# Altium schematic sheet main.SchDoc
size A3; Author: Roniere Rezende; SheetNumber: 1; SheetTotal: 1; SPICEModelCacheXJWXHROJ: <root> / <DocumentId>XJWXHROJ</DocumentId> / <CacheFrame Number="0"> / <Model Name="cap" Kind="MDL"> / <Text>*Default semiconductor capacitor / .MODEL CAP C()</Text> / </Model> / </CacheFrame> / </root>
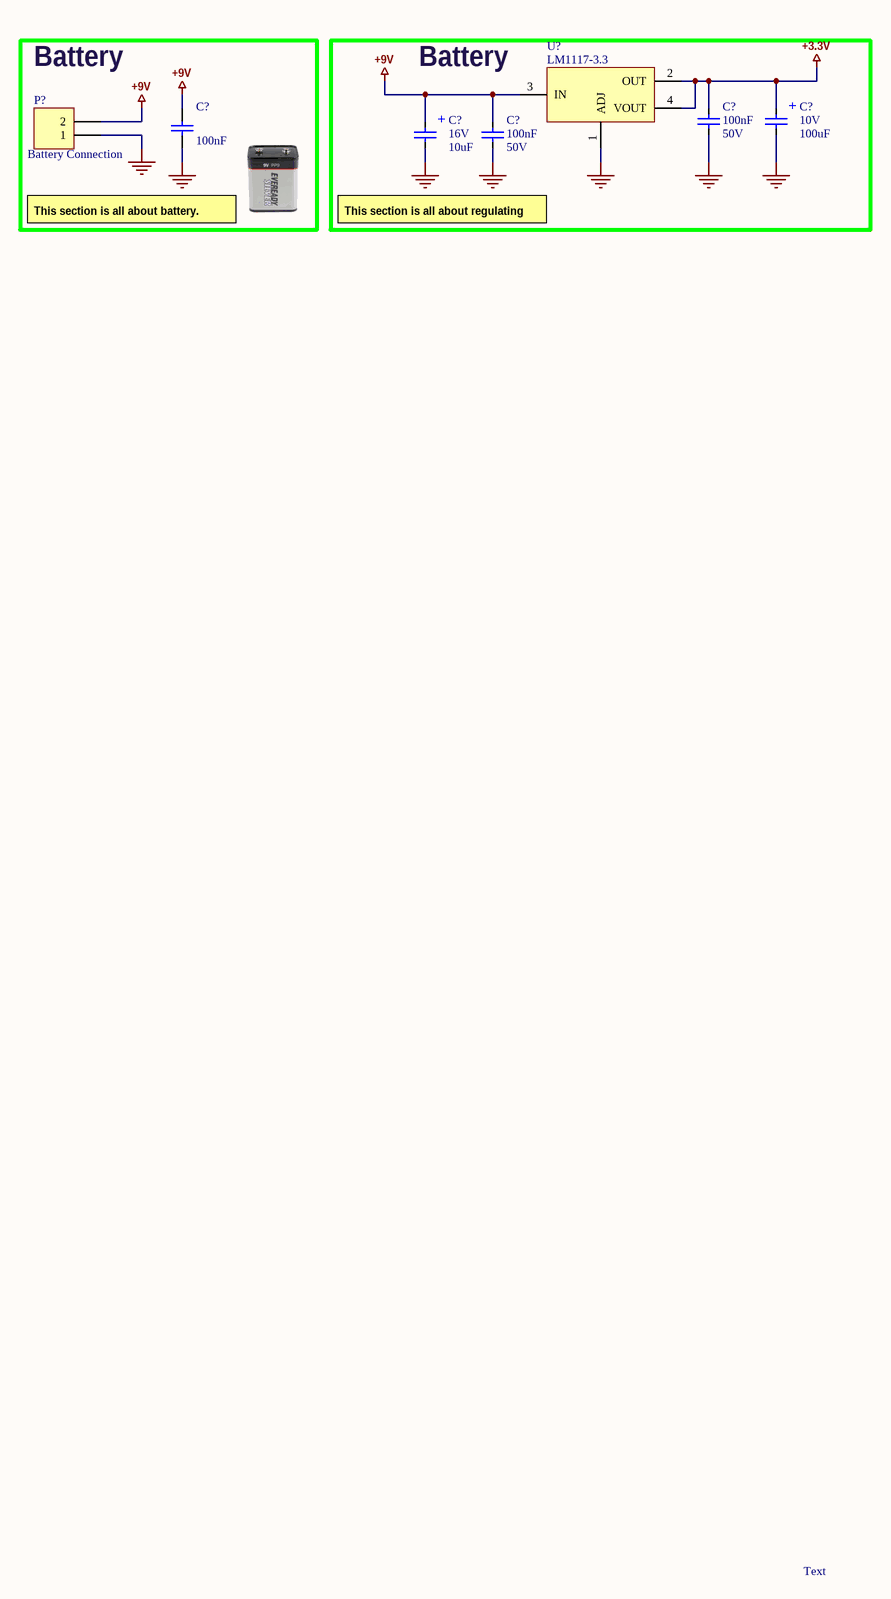
[diagram p0: main.SchDoc]

## Parts
(Parts that share a designator on the sheet are numbered #1, #2 ... from top to bottom, then left to right.)
C?#1  value 100nF  [C1206]  (hidden comment: Cap Semi)
C?#2  Voltage Rating: 50V  Capacitance: 100nF  (hidden comment: CAP CER 0.1UF 50V X7R 0805)
C?#3  Voltage Rating: 10V  Capacitance: 100uF  [CAPACITOR_TAN_1206_H]  (hidden comment: CAP TANT 100UF 20% 10V 1206)
C?#4  Voltage Rating: 16V  Capacitance: 10uF  [CAPACITOR_TAN_1206_H]  (hidden comment: CAP TANT 10UF 10% 16V 1206)
C?#5  Voltage Rating: 50V  Capacitance: 100nF  (hidden comment: CAP CER 0.1UF 50V X7R 0805)
P?  Battery Connection  [HDR1X2H]
U?  Series: LM1117-3.3  [SOT-223-4]  (hidden comment: IC REG LIN 3.3V 800MA SOT223-4)

## Blocks framed on the sheet
Battery: C?#1 P?
Battery: C?#2-C?#5 U?

## Nets
+3.3V: C?#2.2 C?#3.1 U?.2(OUT) U?.4(VOUT)
+9V: C?#1.1 C?#4.1 C?#5.2 P?.2 U?.3(IN)
GND: C?#1.2 C?#2.1 C?#3.2 C?#4.2 C?#5.1 P?.1 U?.1(ADJ)

## Notes on the sheet
- This section is all about battery.
- This section is all about regulating voltage from 9V to 3.3V.
- Text
- (in symbol TAJA106K016RNJ) +
- (in symbol TLJA107M010R1400) +

## Library data of the parts
C?#1 = Cap Semi: Capacitor (Semiconductor SIM Model); Published: 8-Jun-2000; LatestRevisionDate: 29-May-2009; LatestRevisionNote: IPC-7351 Footprint Added.; PackageReference: C1206; Publisher: Altium Limited; PackageDescription: Chip Capacitor
C?#2 C?#5 = CC0805KRX7R9BB104: 0.1 µF ±10% 50V Ceramic Capacitor X7R 0805 (2012 Metric); Manufacturer: Yageo; Insulation Resistance: 100GR; Supplier 1: Future Electronics; Supplier Part Number 1: 2986263; Manufacturer Part Number: CC0805KRX7R9BB104; RoHS: Yes; Category: Ceramic Capacitors; Stock 1: 13596000; Pricing 1: 4000=0.0097, 16000=0.0092, 40000=0.0089, 100000=0.0086, 160000=0.0082 (USD); Mount: Surface Mount; Case/Package: 0805; Number of Pins: 2; Case Code (Metric): 2012; Case Code (Imperial): 0805; Material: Ceramic; Min Operating Temperature: -55°C; Max Operating Temperature: 125°C; Packaging: Tape and Reel; Tolerance: 10%; Package Quantity: 4000; Dielectric: X7R; Termination: SMD/SMT; Voltage: 50V; Series: CC; Length: 2mm; Height: 0.85mm; Depth: 1.25mm; Radiation Hardening: No; Reach SVHC Compliant: No; Lead Free: Lead Free; Halogen Free: Halogen Free; RoHS Compliant: Yes; ComponentLink1URL: https://datasheet.ciiva.com/11786/0900766b80d84f1d-11786009.pdf?src-supplier=Rs; ComponentLink1Description: https://datasheet.ciiva.com/11786/0900766b80d84f1d-11786009.pdf?src-supplier=Rs; ComponentLink2URL: https://datasheet.ciiva.com/155/mlccorderingcode-155929.pdf?src-supplier=Digikey; ComponentLink2Description: https://datasheet.ciiva.com/155/mlccorderingcode-155929.pdf?src-supplier=Digikey; ComponentLink3URL: https://datasheet.ciiva.com/155/mlccorderingcode-155930.pdf?src-supplier=Digikey; ComponentLink3Description: https://datasheet.ciiva.com/155/mlccorderingcode-155930.pdf?src-supplier=Digikey; ComponentLink4URL: https://datasheet.ciiva.com/155/mlccorderingcode-155931.pdf?src-supplier=Digikey; ComponentLink4Description: https://datasheet.ciiva.com/155/mlccorderingcode-155931.pdf?src-supplier=Digikey; ComponentLink5URL: https://datasheet.ciiva.com/11464/upy-gphc-x7r-6-3v-to-50v-8-11464757.pdf?src-supplier=Avnet; ComponentLink5Description: https://datasheet.ciiva.com/11464/upy-gphc-x7r-6-3v-to-50v-8-11464757.pdf?src-supplier=Avnet; ComponentLink6URL: https://datasheet.ciiva.com/46393/1734573-46393307.pdf?src-supplier=Element14; ComponentLink6Description: https://datasheet.ciiva.com/46393/1734573-46393307.pdf?src-supplier=Element14; ComponentLink7URL: https://datasheet.ciiva.com/28450/1489800-28450805.pdf?src-supplier=Element14; ComponentLink7Description: https://datasheet.ciiva.com/28450/1489800-28450805.pdf?src-supplier=Element14; ComponentLink8URL: https://datasheet.ciiva.com/29242/445210-da-01-en-kerko-chip-0805-x7r-0-1uf-10proz-50vg-29242074.pdf?src-supplier=Conrad; ComponentLink8Description: https://datasheet.ciiva.com/29242/445210-da-01-en-kerko-chip-0805-x7r-0-1uf-10proz-50vg-29242074.pdf?src-supplier=Conrad
C?#3 = TLJA107M010R1400: 100 µF Molded Tantalum Capacitors 10 V 1206 (3216 Metric) 1.4Ohm; Manufacturer: Kyocera AVX; ESR (Equivalent Series Resistance): 1.4R; Ripple Current: 231mA; Leakage Current: 10uA; Life (Hours): 2000Hour; Supplier 1: Avnet; Supplier Part Number 1: 11R8390; Manufacturer Part Number: TLJA107M010R1400; RoHS: Yes; Category: Tantalum Capacitors; Stock 1: 2050; Pricing 1: 1=0.863, 10=0.514, 25=0.483, 50=0.45, 100=0.419 (USD); Mount: Surface Mount; Case/Package: 1206; Number of Pins: 2; Case Code (Metric): 3216; Case Code (Imperial): 1206; Dielectric Material: Tantalum; Min Operating Temperature: -55°C; Max Operating Temperature: 125°C; Tolerance: 20%; Packaging: Tape and Reel; Package Quantity: 2000; Resistance: 1.4R; Termination: SMD/SMT; Voltage: 10V; Voltage Rating (DC): 10V; Features: General Purpose; Series: TLJ; Construction: Flat; Length: 3.2mm; Width: 1.6mm; Height: 1.6mm; Depth: 1.6mm; Lead Pitch: 1.1mm; Radiation Hardening: No; Lead Free: Lead Free; RoHS Compliant: Yes; ComponentLink1URL: https://datasheet.ciiva.com/264/tlj-264792.pdf?src-supplier=Digikey; ComponentLink1Description: https://datasheet.ciiva.com/264/tlj-264792.pdf?src-supplier=Digikey; ComponentLink2URL: https://datasheet.ciiva.com/264/tlj-264793.pdf?src-supplier=Digikey; ComponentLink2Description: https://datasheet.ciiva.com/264/tlj-264793.pdf?src-supplier=Digikey; ComponentLink3URL: https://datasheet.ciiva.com/264/tlj-264794.pdf?src-supplier=Digikey; ComponentLink3Description: https://datasheet.ciiva.com/264/tlj-264794.pdf?src-supplier=Digikey; ComponentLink4URL: https://datasheet.ciiva.com/11226/tlj-11226140.pdf?src-supplier=Avnet; ComponentLink4Description: https://datasheet.ciiva.com/11226/tlj-11226140.pdf?src-supplier=Avnet; ComponentLink5URL: https://datasheet.ciiva.com/16501/tlj-16501342.pdf?src-supplier=Future+Electronics; ComponentLink5Description: https://datasheet.ciiva.com/16501/tlj-16501342.pdf?src-supplier=Future+Electronics
C?#4 = TAJA106K016RNJ: 10 µF Molded Tantalum Capacitors 16 V 1206 (3216 Metric) 3Ohm; Manufacturer: Kyocera AVX; ESR (Equivalent Series Resistance): 3R; Leakage Current: 1.6uA; Dissipation Factor: 8%; Polarity: Polar; Frequency: 300MHz; Life (Hours): 2000Hour; Ripple Current: 158mA; Supplier 1: Avnet; Supplier Part Number 1: TAJA106K016RNJ; Manufacturer Part Number: TAJA106K016RNJ; RoHS: Yes; Category: Tantalum Capacitors; Stock 1: 284000; Pricing 1: 2000=0.08497, 4000=0.08299, 8000=0.08102, 12000=0.07904, 16000=0.07805 (USD); Mount: Surface Mount,PCB; Case/Package: 1206; Number of Pins: 2; Case Code (Metric): 3216; Case Code (Imperial): 1206; Dielectric Material: Tantalum; Min Operating Temperature: -55°C; Max Operating Temperature: 125°C; Tolerance: 10%; Packaging: Tape and Reel; Voltage Rating (DC): 16V; Features: General Purpose; Series: TAJ; Construction: Flat; Package Quantity: 1; Termination: SMD/SMT; Voltage: 16V; Voltage Rating (AC): 16V; Length: 3.2mm; Width: 1.6mm; Height: 1.6mm; Depth: 1.6mm; Size: 1.6mm; Height - Seated (Max): 0.071inch; Lead Pitch: 1.1mm; Radiation Hardening: No; Lead Free: Lead Free; RoHS Compliant: Yes; Reach SVHC Compliant: No; ComponentLink1URL: https://datasheet.ciiva.com/27051/1234933-27051768.pdf?src-supplier=Jameco; ComponentLink1Description: https://datasheet.ciiva.com/27051/1234933-27051768.pdf?src-supplier=Jameco; ComponentLink2URL: https://datasheet.ciiva.com/26341/559411-da-01-en-tacc-a-3-2-mm-x-1-6-mm-x-1-6-mm-10-uf-26341755.pdf?src-supplier=Conrad; ComponentLink2Description: https://datasheet.ciiva.com/26341/559411-da-01-en-tacc-a-3-2-mm-x-1-6-mm-x-1-6-mm-10-uf-26341755.pdf?src-supplier=Conrad; ComponentLink3URL: https://datasheet.ciiva.com/263/taj-263391.pdf?src-supplier=Digikey; ComponentLink3Description: https://datasheet.ciiva.com/263/taj-263391.pdf?src-supplier=Digikey; ComponentLink4URL: https://datasheet.ciiva.com/263/taj-263392.pdf?src-supplier=Digikey; ComponentLink4Description: https://datasheet.ciiva.com/263/taj-263392.pdf?src-supplier=Digikey; ComponentLink5URL: https://datasheet.ciiva.com/263/taj-263393.pdf?src-supplier=Digikey; ComponentLink5Description: https://datasheet.ciiva.com/263/taj-263393.pdf?src-supplier=Digikey; ComponentLink6URL: https://datasheet.ciiva.com/3004/taj-3004387.pdf?src-supplier=Avnet; ComponentLink6Description: https://datasheet.ciiva.com/3004/taj-3004387.pdf?src-supplier=Avnet; ComponentLink7URL: https://datasheet.ciiva.com/3004/taj-3004388.pdf?src-supplier=Avnet; ComponentLink7Description: https://datasheet.ciiva.com/3004/taj-3004388.pdf?src-supplier=Avnet; ComponentLink8URL: https://datasheet.ciiva.com/16379/taj-16379015.pdf?src-supplier=Future+Electronics; ComponentLink8Description: https://datasheet.ciiva.com/16379/taj-16379015.pdf?src-supplier=Future+Electronics; ComponentLink9URL: https://datasheet.ciiva.com/7730/1703059-7730712.pdf?src-supplier=Element14; ComponentLink9Description: https://datasheet.ciiva.com/7730/1703059-7730712.pdf?src-supplier=Element14; ComponentLink10URL: https://datasheet.ciiva.com/7730/1703059-7730713.pdf?src-supplier=Element14; ComponentLink10Description: https://datasheet.ciiva.com/7730/1703059-7730713.pdf?src-supplier=Element14; ComponentLink11URL: https://datasheet.ciiva.com/7730/1680476-7730714.pdf?src-supplier=Element14; ComponentLink11Description: https://datasheet.ciiva.com/7730/1680476-7730714.pdf?src-supplier=Element14; ComponentLink12URL: https://datasheet.ciiva.com/7730/taj-7730975.pdf?src-supplier=Element14; ComponentLink12Description: https://datasheet.ciiva.com/7730/taj-7730975.pdf?src-supplier=Element14; ComponentLink13URL: https://datasheet.ciiva.com/18710/taj-eng-18710622.pdf?src-supplier=Distrelec; ComponentLink13Description: https://datasheet.ciiva.com/18710/taj-eng-18710622.pdf?src-supplier=Distrelec; ComponentLink14URL: https://datasheet.ciiva.com/12882/taj-27497-12882509.pdf?src-supplier=Mouser; ComponentLink14Description: https://datasheet.ciiva.com/12882/taj-27497-12882509.pdf?src-supplier=Mouser
P? = Header 2H: Header, 2-Pin, Right Angle; Voltage: +9V; LatestRevisionDate: 17-Jul-2002; LatestRevisionNote: Re-released for DXP Platform.; Publisher: Altium Limited
U? = LM1117IMPX-3.3/NOPB: 800-mA 15-V linear voltage regulator ; 4-SOT-223 -40 to 125; Manufacturer: Texas Instruments; Max Input Voltage: 15V; Dropout Voltage: 1.2V; Number of Outputs: 1; Polarity: Positive; Quiescent Current: 15mA; Accuracy: 1%; Output Type: Fixed; Min Input Voltage: 2.6V; Max Supply Current: 10mA; Power Supply Rejection Ratio (PSRR): 75dB; Supplier 1: Mouser; Supplier Part Number 1: 926-LM1117IMPX33NOPB; Manufacturer Part Number: LM1117IMPX-3.3/NOPB; RoHS: Yes; Category: Voltage Regulators - Linear; Stock 1: 43959; Pricing 1: 1=1.14, 10=0.965, 50=0.965, 100=0.741, 1000=0.517, 10000=0.44 (USD); Mount: Surface Mount; Case/Package: SOT-223; Number of Pins: 4; Min Operating Temperature: -40°C; Max Operating Temperature: 125°C; Output Voltage: 3.3V; Nominal Output Voltage: 3.3V; Output Current: 800mA; Packaging: Tape and Reel; Max Output Current: 800mA; Number of Regulators: 1; Min Current Limit: 800mA; Output Voltage Accuracy: 1%; Output Configuration: Positive; Number of Channels: 1; Length: 6.5mm; Width: 3.5mm; Height: 1.8mm; Thickness: 1.6mm; Radiation Hardening: No; Reach SVHC Compliant: No; Lead Free: Lead Free; RoHS Compliant: Yes; ComponentLink1URL: https://datasheet.ciiva.com/46386/1882372-46386044.pdf?src-supplier=Element14; ComponentLink1Description: https://datasheet.ciiva.com/46386/1882372-46386044.pdf?src-supplier=Element14; ComponentLink2URL: https://datasheet.ciiva.com/49047/1882372-49047126.pdf?src-supplier=Element14; ComponentLink2Description: https://datasheet.ciiva.com/49047/1882372-49047126.pdf?src-supplier=Element14